# Altium schematic sheet rxdown_blank.SchDoc
size Letter; SheetNumber: 9; SheetTotal: 9
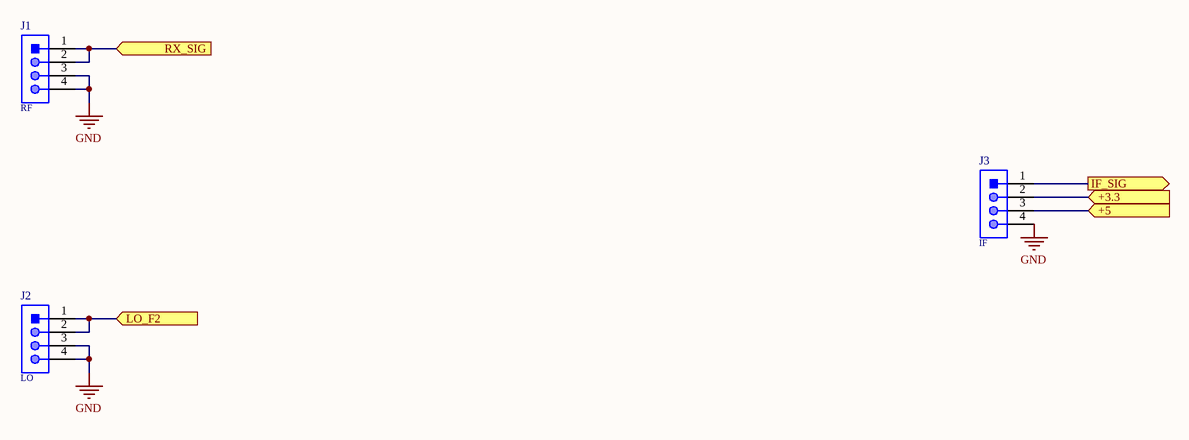
[diagram p0: rxdown_blank.SchDoc]

## Parts
J1  RF  [61300411121]
J2  LO  [61300411121]
J3  IF  [61300411121]

## Ports
+3.3 (in), +5 (in), IF_SIG (out), LO_F2 (in), RX_SIG (in)

## Nets
GND: J1.3 J1.4 J2.3 J2.4 J3.4
+3.3: J3.2 ; port +3.3
+5: J3.3 ; port +5
IF_SIG: J3.1 ; port IF_SIG
LO_F2: J2.1 J2.2 ; port LO_F2
RX_SIG: J1.1 J1.2 ; port RX_SIG

## Library data of the parts
J1-J3 = CMP-1502-01064-1: THT Vertical Pin Header WR-PHD, Pitch 2.54 mm, Single Row, 4 pins; Manufacturer: Wurth Elektronik; Withstanding Voltage: 500VAC; Rated Current: 3A; Working Voltage: 250VAC; Pin Number: 4; Gender: Male; Contact Resistance: 20mOhm; Pitch: 2.54mm; Manufacturer URL: http://www.we-online.de; Operating Temperature: -40to105degC; Packaging: Bag; Mounting Technology: THT; Package Reference: 61300411121; Datasheet URL: https://katalog.we-online.de/em/datasheet/6130xx11121.pdf; Publisher: WurthElektronik; Part Number: 61300411121; Row Number: Single; Orientation: Vertical